# Altium schematic sheet Power.SchDoc: Power
size 279 x 215 mm; Engineer: Prasoon Sinha; DocumentNumber: 23; SheetNumber: 23; SheetTotal: 26
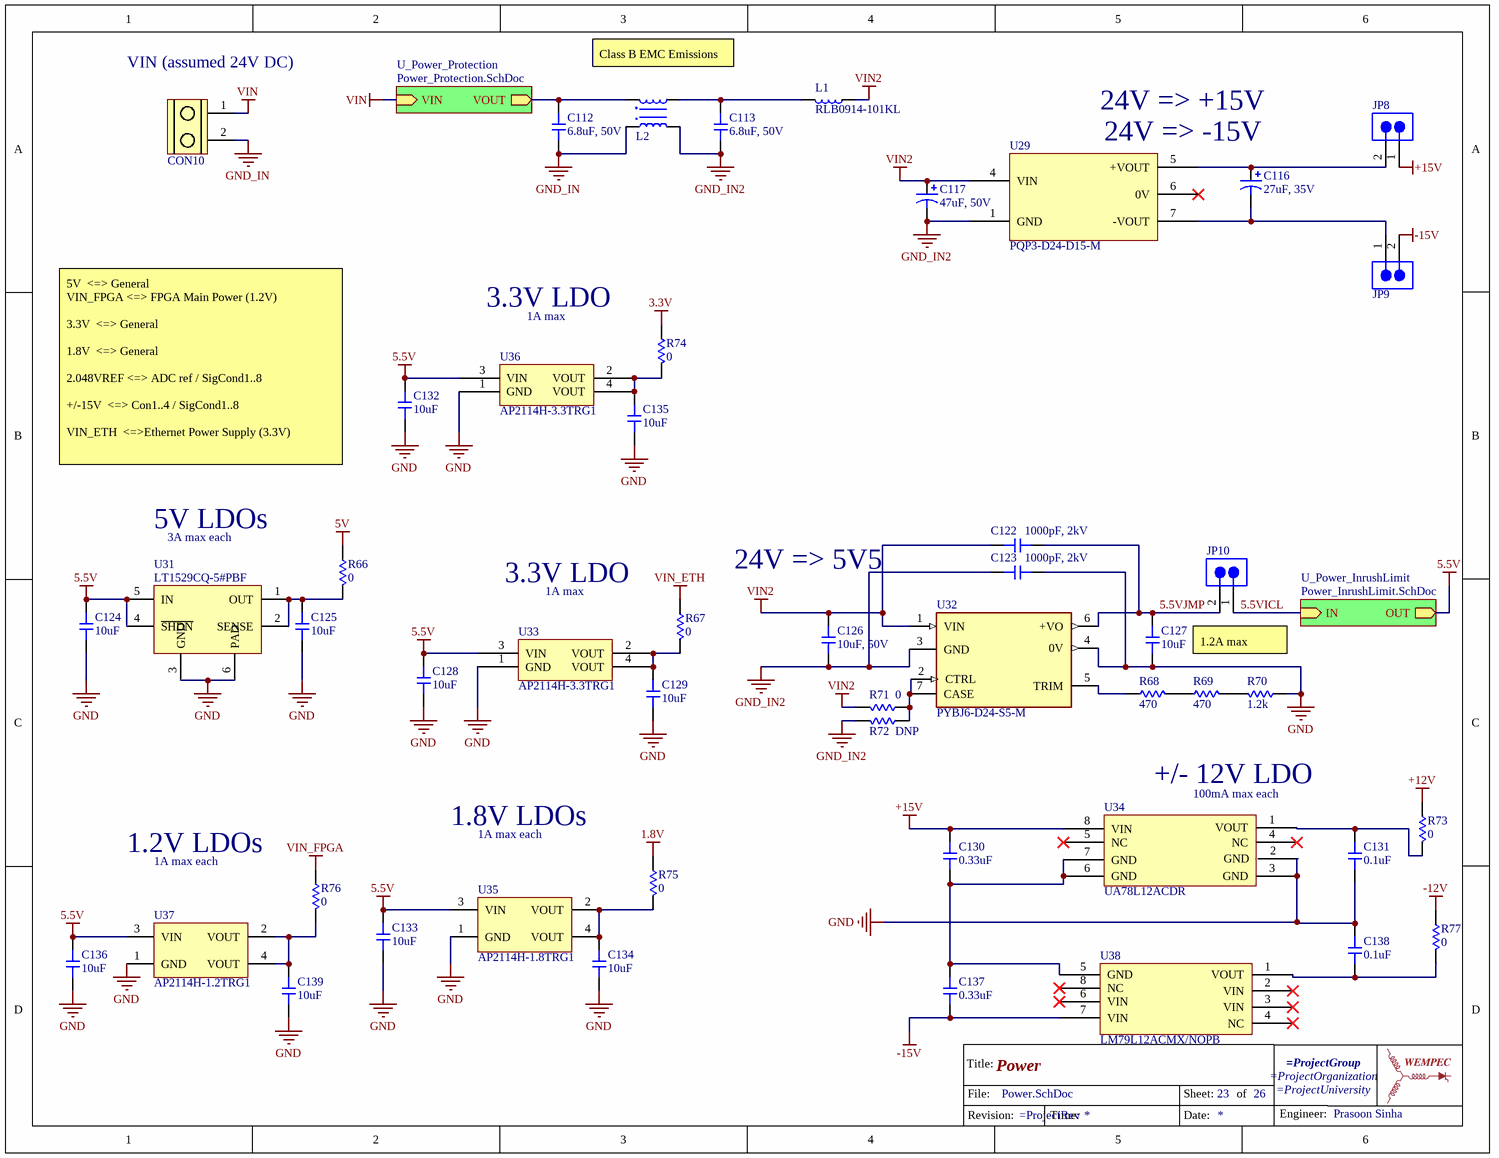
[diagram p0: Power.SchDoc]

## Parts
*?  TitleBlockWEMPEC  (value not drawn)  (graphical)
C112  value 6.8uF, 50V  [1812-CAP]  (hidden comment: Capacitor)
C113  value 6.8uF, 50V  [1812-CAP]  (hidden comment: Capacitor)
C116  value 27uF, 35V  [EEV336M035A9GAA]  (hidden comment: Cap Pol1)
C117  value 47uF, 50V  [EDH476M050A9HAA]  (hidden comment: Cap Pol1)
C122  value 1000pF, 2kV  [1808-CAP]  (hidden comment: Capacitor)
C123  value 1000pF, 2kV  [1808-CAP]  (hidden comment: Capacitor)
C124  value 10uF  [0603-CAP]  (hidden comment: Capacitor)
C125  value 10uF  [0603-CAP]  (hidden comment: Capacitor)
C126  value 10uF, 50V  [0805 Cap]  (hidden comment: Capacitor)
C127  value 10uF  [0603-CAP]  (hidden comment: Capacitor)
C128  value 10uF  [0603-CAP]  (hidden comment: Capacitor)
C129  value 10uF  [0603-CAP]  (hidden comment: Capacitor)
C130  value 0.33uF  [0603-CAP]  (hidden comment: Capacitor)
C131  value 0.1uF  [0603-CAP]  (hidden comment: Capacitor)
C132  value 10uF  [0603-CAP]  (hidden comment: Capacitor)
C133  value 10uF  [0603-CAP]  (hidden comment: Capacitor)
C134  value 10uF  [0603-CAP]  (hidden comment: Capacitor)
C135  value 10uF  [0603-CAP]  (hidden comment: Capacitor)
C136  value 10uF  [0603-CAP]  (hidden comment: Capacitor)
C137  value 0.33uF  [0603-CAP]  (hidden comment: Capacitor)
C138  value 0.1uF  [0603-CAP]  (hidden comment: Capacitor)
C139  value 10uF  [0603-CAP]  (hidden comment: Capacitor)
CON10  ScrewTerminal_1x2  [1935161]  (value not drawn)
JP8  Jumper2  [PIN_HEADER_1x2]  (value not drawn)
JP9  Jumper2  [PIN_HEADER_1x2]  (value not drawn)
JP10  Jumper2  [PIN_HEADER_1x2]  (value not drawn)
L1  RLB0914-101KL  [RLB0914]
L2  CMC  744273801  [CMC 744273801]  (value not drawn)
R66  value 0  [1206-RES]  (hidden comment: Resistor)
R67  value 0  [1206-RES]  (hidden comment: Resistor)
R68  value 470  [0603-RES]  (hidden comment: Resistor)
R69  value 470  [0603-RES]  (hidden comment: Resistor)
R70  value 1.2k  [0603-RES]  (hidden comment: Resistor)
R71  value 0  [1206-RES]  (hidden comment: Resistor)
R72  value DNP  [1206-RES]  (hidden comment: Resistor)
R73  value 0  [1206-RES]  (hidden comment: Resistor)
R74  value 0  [1206-RES]  (hidden comment: Resistor)
R75  value 0  [1206-RES]  (hidden comment: Resistor)
R76  value 0  [1206-RES]  (hidden comment: Resistor)
R77  value 0  [1206-RES]  (hidden comment: Resistor)
U29  PQP3-D24-D15-M  [CONV_PQP3-D24-D15-M]
U31  LT1529CQ-5#PBF  [5-DDPAK]
U32  PYBJ6-D24-S5-M  [CONV_PYBJ6-D24-S5-M]
U33  AP2114H-3.3TRG1  [SOT230P700X180-4N]
U34  UA78L12ACDR  [SOIC127P599X175-8N]
U35  AP2114H-1.8TRG1  [SOT230P700X180-4N]
U36  AP2114H-3.3TRG1  [SOT230P700X180-4N]
U37  AP2114H-1.2TRG1  [SOT230P700X180-4N]
U38  LM79L12ACMX/NOPB  [SOIC127P599X175-8N]

## Sub-sheets
U_Power_InrushLimit = Power_InrushLimit.SchDoc: IN (in), OUT (out)
U_Power_Protection = Power_Protection.SchDoc: VIN (in), VOUT (out)

## Nets
1.8V: R75.1
3.3V: R74.1
5.5V: C124.1 C128.1 C132.1 C133.1 C136.1 U31.4(~{SHDN}) U31.5(IN) U33.3(VIN) U35.3(VIN) U36.3(VIN) U37.3(VIN) ; sheet U_Power_InrushLimit/OUT
5V: R66.1
+12V: R73.1
+15V: C130.1 JP8.1 U34.8(VIN)
-12V: R77.1
-15V: C137.2 JP9.2 U38.7(VIN)
GND: C123.2 C124.2 C125.2 C127.1 C128.2 C129.2 C131.2 C132.2 C133.2 C134.2 C135.2 C136.2 C138.1 C139.2 R70.1 U31.3(GND) U31.6(PAD) U32.4(0V) U33.1(GND) U34.2(GND) U34.3(GND) U35.1(GND) U36.1(GND) U37.1(GND)
GND_IN: C112.1 CON10.2 L2.2
GND_IN2: C113.1 C117.2 C123.1 C126.1 L2.3 R72.2 U29.1(GND) U32.3(GND)
VIN: CON10.1 ; sheet U_Power_Protection/VIN
VIN2: C117.1 C122.1 C126.2 L1.2 R71.2 U29.4(VIN) U32.1(VIN)
VIN_ETH: R67.1
VIN_FPGA: R76.1
5.5VICL: JP10.1 ; sheet U_Power_InrushLimit/IN
5.5VJMP: C122.2 C127.2 JP10.2 U32.6(+VO)
NetC112_2: C112.2 L2.1 ; sheet U_Power_Protection/VOUT
NetC113_2: C113.2 L1.1 L2.4
NetC116_1: C116.1 JP8.2 U29.5(+VOUT)
NetC116_2: C116.2 JP9.1 U29.7(-VOUT)
NetC125_1: C125.1 R66.2 U31.1(OUT) U31.2(SENSE)
NetC129_1: C129.1 R67.2 U33.2(VOUT) U33.4(VOUT)
NetC130_2: C130.2 C137.1 U34.6(GND) U34.7(GND) U38.5(GND)
NetC131_1: C131.1 R73.2 U34.1(VOUT)
NetC134_1: C134.1 R75.2 U35.2(VOUT) U35.4(VOUT)
NetC135_1: C135.1 R74.2 U36.2(VOUT) U36.4(VOUT)
NetC138_2: C138.2 R77.2 U38.1(VOUT)
NetC139_1: C139.1 R76.2 U37.2(VOUT) U37.4(VOUT)
NetR68_1: R68.1 U32.5(TRIM)
NetR68_2: R68.2 R69.1
NetR69_2: R69.2 R70.2
NetR71_1: R71.1 R72.1 U32.2(CTRL) U32.7(CASE)

Not connected (* = marked no-connect by the designer): U29 6(0V)*; U34 4(NC)* 5(NC)*; U38 2(VIN)* 3(VIN)* 4(NC)* 6(VIN)* 8(NC)*

## Notes on the sheet
- (near CON10) VIN (assumed 24V DC)
- Class B EMC Emissions
- 24V => +15V
- 24V => -15V
- 3.3V LDO
- 1A max
- 5V		<=> General
  VIN_FPGA	<=> FPGA Main Power (1.2V)
  3.3V		<=> General
  1.8V		<=> General
  2.048VREF	<=> ADC ref / SigCond1..8
  +/-15V		<=> Con1..4 / SigCond1..8
  VIN_ETH		<=>Ethernet Power Supply (3.3V)
- 5V LDOs
- 3A max each
- 24V => 5V5
- 1.2A max
- (near U34) +/- 12V LDO
- 1.2V LDOs
- 1.8V LDOs
- 1A max each
- (near U34) 100mA max each
- (in symbol TitleBlockWEMPEC) Title:; File:; Sheet:; of; Engineer:; Revision:; Time:; Date:

## Library data of the parts
C116 C117 = Cap Pol1: Polarized Capacitor (Radial); Supplier 1: Digi-Key
  C116: Supplier Part Number 1: 399-18141-1-ND
  C117: Supplier Part Number 1: 399-18135-1-ND
L1 = RLB0914-101KL: 100µH Unshielded Wirewound Inductor 1.1A 280mOhm Max Radial, Vertical Cylinder /; Supplier Part Number 1: RLB0914-101KL-ND
L2 = CMC  744273801: CMC 450UH 6.5A 2LN TH; Supplier 1: Digi-Key; Supplier Part Number 1: 732-2215-1-ND
U29 = PQP3-D24-D15-M: Isolated Module DC DC Converter 2 Output 15V -15V 100mA, 100mA 18V - 36V Input; Supplier Part Number 1: 102-PQP3-D24-D15-M-ND
U31 = LT1529CQ-5#PBF: IC REG LINEAR 5V 3A 5DDPAK; Supplier 1: Digi-Key; Supplier Part Number 1: LT1529CQ-5#PBF-ND
U32 = PYBJ6-D24-S5-M: Isolated Module DC DC Converter 1 Output 5V 1.2A 18V - 36V Input; Supplier Part Number 1: 102-6611-ND
U33 U36 = AP2114H-3.3TRG1: IC REG LINEAR 3.3V 1A SOT223; Supplier 1: Digi-Key; Supplier Part Number 1: AP2114H-3.3TRG1DICT-ND
U34 = UA78L12ACDR: Linear Voltage Regulator IC 1 Output 100mA 8-SOIC; Supplier Part Number 1: 296-15054-1-ND
U35 = AP2114H-1.8TRG1: Linear Voltage Regulator IC 1 Output 1A SOT-223; Supplier Part Number 1: AP2114H-1.8TRG1DICT-ND
U37 = AP2114H-1.2TRG1: IC REG LINEAR 1.2V 1A SOT223; Supplier Part Number 1: AP2114H-1.2TRG1DICT-ND
U38 = LM79L12ACMX/NOPB: Linear Voltage Regulator IC 1 Output 100mA 8-SOIC; Supplier Part Number 1: LM79L12ACMX/NOPBCT-ND
C112 C113 C122-C139 = Capacitor: Supplier 1: Digi-Key
  C112 C113: Supplier Part Number 1: 445-3919-1-ND
  C122 C123: Supplier Part Number 1: 709-1046-1-ND
  C124 C125 C128 C129 C132-C136 C139: Supplier Part Number 1: 1276-1192-1-ND
  C126: Supplier Part Number 1: 490-18663-1-ND
  C127: Supplier Part Number 1: 445-9015-1-ND
  C130 C137: Supplier Part Number 1: 1276-2048-1-ND
  C131 C138: Supplier Part Number 1: 1276-1012-1-ND
CON10 = ScrewTerminal_1x2: Supplier 1: Digi-Key; Supplier Part Number 1: 277-1667-ND
JP8-JP10 = Jumper2: Supplier 1: Digi-Key; Supplier Part Number 1: 732-5315-ND
R66-R77 = Resistor: Supplier 1: Digi-Key
  R66 R67 R71-R77: Supplier Part Number 1: 311-0.0ERCT-ND
  R68 R69: Supplier Part Number 1: 311-470LDCT-ND
  R70: Supplier Part Number 1: 311-1.20KHRCT-ND